# EAGLE design climbingRGB_bolt (EAGLE 6.3)
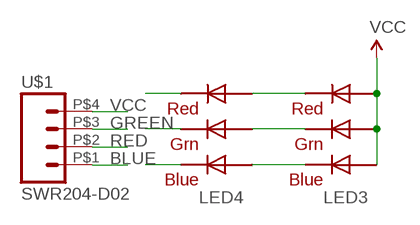
[diagram p0: schematic, sheet 1]

## Parts
LED3  RGBLED5050  [RGBLED5050]
LED4  RGBLED5050  [RGBLED5050]
U$1  SWR204-D02  [SWR204]

## Nets
BLUE: LED4.4(BLUE_C) U$1.P$1
GREEN: LED4.6(GREEN_C) U$1.P$3
N$1: LED3.4(BLUE_C) LED4.3(BLUE_A)
N$5: LED3.6(GREEN_C) LED4.1(GREEN_A)
N$6: LED3.5(RED_C) LED4.2(RED_A)
RED: LED4.5(RED_C) U$1.P$2
VCC: LED3.1(GREEN_A) LED3.2(RED_A) LED3.3(BLUE_A) U$1.P$4

## Library data of the parts
LED3 LED4 = adafruit:RGBLED: For 5050 RGB LEDs, the order of the LEDs may vary from one manufacturer to another!
U$1 = SparkFun-Connectors:SWR204-D02

## Board
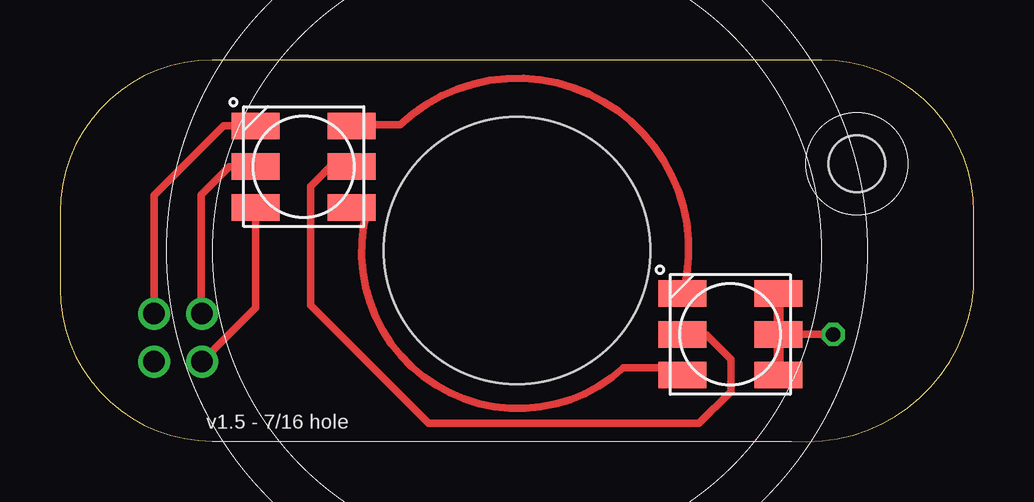
[diagram p1: board, top side]
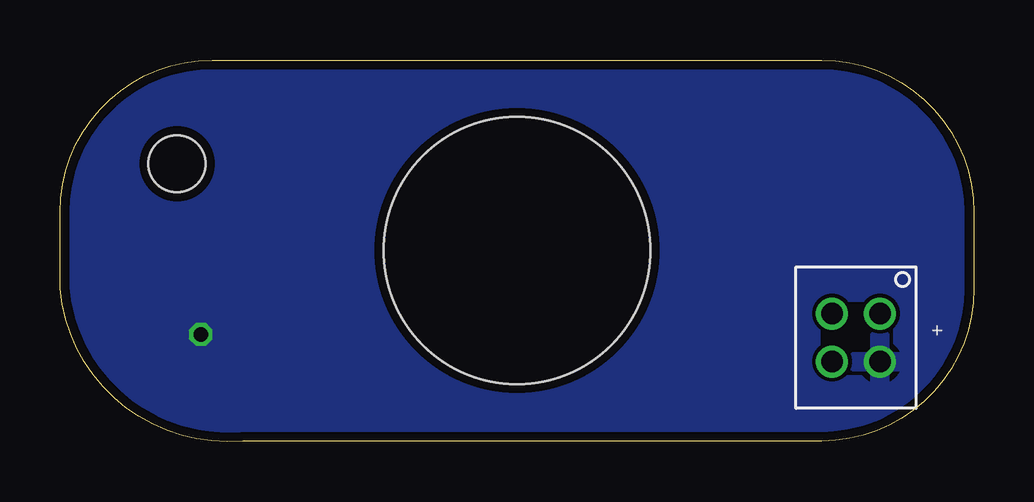
[diagram p2: board, bottom side, seen from below]

Size 38.1 x 15.9 mm. Coordinates in mm from the lower left corner, seen from the top.
Outline: 0,9.55 0,6.38 arc90 6.35,0.03 30.48,0.03 arc90 38.1,6.38 38.1,9.55 arc90 31.75,15.9 6.35,15.9 arc90 0,9.55
Copper layers (1*16): Top 0.0356mm / dielectric 1.5011mm / Bottom 0.0356mm
Design rules "LaenPCBOrder": minimum track width 6mil, minimum drill 13mil, track to track 6mil, track to pad 6mil, pad to pad 6mil, via to via 6mil, smd to smd 6mil, copper to edge 15mil, drill to drill 6mil, minimum pad ring 7mil, minimum via ring 7mil, stop-mask expansion 4mil, vias tented up to drill 0mil, thermal gap 10mil
Holes 11.11 mm at 19.05,7.97
Holes 2.36 mm at 33.22,11.59

### Footprints (pad centres in the part's own frame; a part is rotated, then mirrored left to right if it is on the bottom)
RGBLED5050 = smd 2 x 1.1: 1 -2,1.7; 2 -2,0; 3 -2,-1.7; 4 2,-1.7; 5 2,0; 6 2,1.7
SWR204 = drill 0.889: P$1 -0.99,0.96; P$2 -0.99,-1.04; P$3 1.01,-1.04; P$4 1.01,0.96

### Placement (x,y rotation side)
LED3  27.94,4.47 180 top
LED4  10.16,11.46 180 top
U$1  4.88,4.35 270 bottom

### Tracks (layer width: path | path; a pad name or v marks a point on that pad's centre or on a via)
BLUE
  Top 0.305: LED4.4 6.83,13.16 3.94,10.26 3.94,5.36 U$1.P$1
GREEN
  Top 0.305: U$1.P$3 6.87,4.29 7.16,4.58 8.16,5.58 LED4.6
N$1
  Top 0.305: LED4.3 12.21,13.21 14.17,13.21 arc-147 26.01,6.3 26.01,6.24 LED3.4
N$5
  Top 0.305: LED4.1 12.29,9.63 12.8,9.63 arc147 23.5,3.08 25.64,3.08 LED3.6
N$6
  Top 0.305: LED4.2 11.25,11.46 10.44,10.65 10.44,5.69 15.37,0.77 26.64,0.77 27.96,2.09 27.96,3.43 26.95,4.45 25.96,4.45 LED3.5
RED
  Top 0.305: LED4.5 7.06,11.46 5.89,10.29 5.89,5.36 U$1.P$2
VCC  (via drill 0.6)
  Top 0.305: v32.23,4.47 LED3.2
  Top 0.406: LED3.3 LED3.2 LED3.1
  pour Bottom (rank 6): 38.1,9.55 38.1,6.38 arc-90 30.48,0.03 6.35,0.03 arc-90 0,6.38 0,9.55 arc-90 6.35,15.9 30.48,15.9 arc-90

### Text on the board
tNames: v1.5 - 7/16 hole
bNames: +